# Altium schematic sheet Interface_2 SCH.SchDoc
size A4
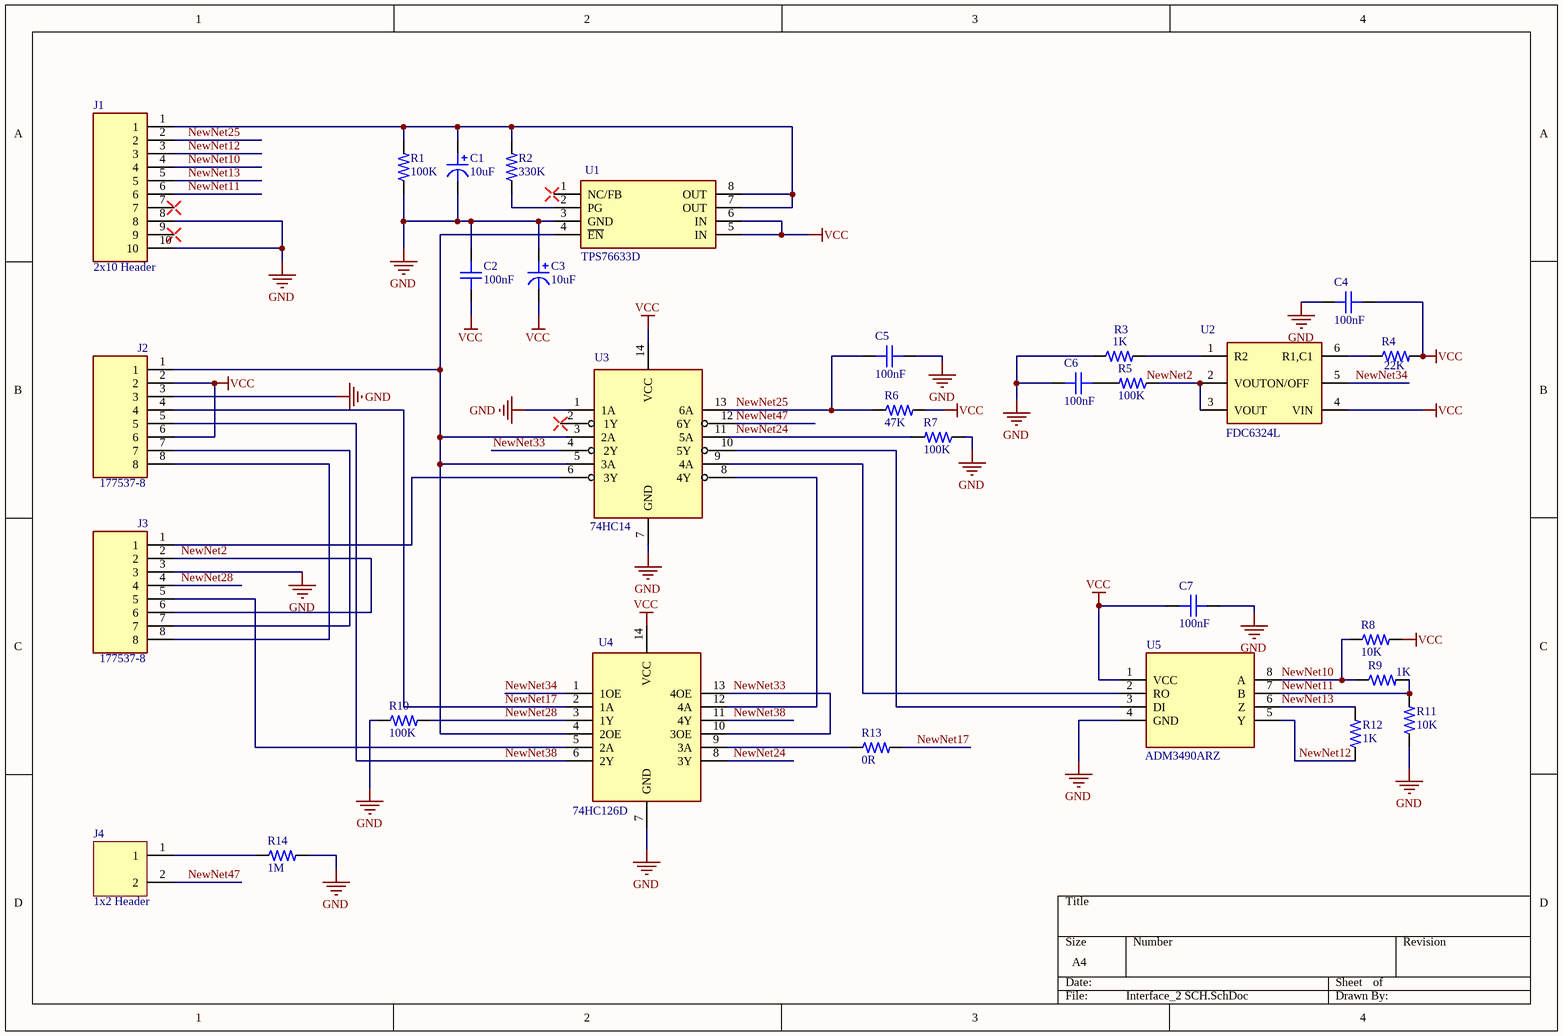
[diagram p0: Interface_2 SCH.SchDoc]

## Parts
C1  10uF  [CASE-B]
C2  100nF  [CAPC2012X14N(0805)]
C3  10uF  [CASE-B]
C4  100nF  [CAPC2012X14N(0805)]
C5  100nF  [CAPC2012X14N(0805)]
C6  100nF  [CAPC2012X14N(0805)]
C7  100nF  [CAPC2012X14N(0805)]
J1  2x10 Header  [HEADER-2x10H]
J2  177537-8  [HEADER-1X8H]
J3  177537-8  [HEADER-1X8H]
J4  1x2 Header  [HEADER-1X2H]
R1  100K  [RESC2013X70N(0805)]
R2  330K  [RESC2013X70N(0805)]
R3  1K  [RESC2013X70N(0805)]
R4  22K  [RESC2013X70N(0805)]
R5  100K  [RESC2013X70N(0805)]
R6  47K  [RESC2013X70N(0805)]
R7  100K  [RESC2013X70N(0805)]
R8  10K  [RESC2013X70N(0805)]
R9  1K  [RESC2013X70N(0805)]
R10  100K  [RESC2013X70N(0805)]
R11  10K  [RESC2013X70N(0805)]
R12  1K  [RESC2013X70N(0805)]
R13  0R  [RESC2013X70N(0805)]
R14  1M  [RESC2013X70N(0805)]
U1  TPS76633D  [SOIC-8]
U2  FDC6324L  [SUPERSOT-6]
U3  74HC14  [SO-14]
U4  74HC126D  [SO-14]
U5  ADM3490ARZ  [SOIC-8]

## Nets
GND: C1.2 C2.2 C3.1 C4.2 C5.1 C6.2 C7.1 J1.8 J1.10 J2.3 J3.3 R1.1 R3.1 R7.1 R10.1 R11.1 R14.2 U1.3(GND) U3.1(1A) U3.7(GND) U4.7(GND) U5.4(GND)
VCC: C2.1 C3.2 C4.1 C7.2 J2.2 J2.6 R4.2 R6.2 R8.2 U1.5(IN) U1.6(IN) U2.4(VIN) U3.14(VCC) U4.14(VCC) U5.1(VCC)
NewNet2: J3.2 J3.6
NewNet10: J1.4 R8.1 R9.1 U5.8(A)
NewNet11: J1.6 R9.2 R11.2 U5.7(B)
NewNet12: J1.3 R12.1 U5.5(Y)
NewNet13: J1.5 R12.2 U5.6(Z)
NewNet17: J2.4 R13.2 U4.2(1A)
NewNet24: R7.2 U3.11(5A) U4.8(3Y)
NewNet25: C5.2 J1.2 R6.1 U3.13(6A)
NewNet28: J3.4 R10.2 U4.3(1Y)
NewNet33: U3.4(2Y) U4.10(3OE) U4.13(4OE)
NewNet34: U2.5 U4.1(1OE)
NewNet38: J2.5 U4.6(2Y) U4.11(4Y)
NewNet47: J4.2 U3.12(6Y)
NetC1_1: C1.1 J1.1 R1.2 R2.2 U1.7(OUT) U1.8(OUT)
NetC6_1: C6.1 R5.2
NetJ2_1: J2.1 U1.4(~{EN}) U3.3(2A) U3.5(3A) U4.4(2OE)
NetJ2_7: J2.7 J3.7
NetJ2_8: J2.8 J3.8
NetJ3_1: J3.1 U3.6(3Y)
NetJ3_5: J3.5 U4.5(2A)
NetJ4_1: J4.1 R14.1
NetR2_1: R2.1 U1.2(PG)
NetR3_2: R3.2 U2.1(R2)
NetR4_1: R4.1 U2.6(R1,C1)
NetR5_1: R5.1 U2.2(VOUTON/OFF) U2.3(VOUT)
NetR13_1: R13.1 U4.9(3A)
NetU3_8: U3.8(4Y) U4.12(4A)
NetU3_9: U3.9(4A) U5.2(RO)
NetU3_10: U3.10(5Y) U5.3(DI)

Not connected (* = marked no-connect by the designer): J1 7 9; U1 1(NC/FB); U3 2(1Y)

## Notes on the sheet
- Labels drawn without touching a wire or pin: NewNet2

## Library data of the parts
C1 C3 = 293D106X0004A2TE3: Cap Tant Solid 10uF 4V A CASE 20% (3.2 X 1.6 X 1.6mm) SMD 3216-18 5.1 Ohm 125C T/R; Manufacturer: Vishay Sprague; Component: 22; Dielectric Material: Tantalum; Voltage Rating (DC): 0uV; Dissipation Factor: 6%; Polarity: Polar; ESR (Equivalent Series Resistance): 5.1R; Manufacturer Part Number: 293D106X0004A2TE3; Supplier 1: Avnet; Supplier Part Number 1: 293D106X0004A2TE3; RoHS: Yes; Category: Tantalum Capacitors; Pricing 1: 2000=0,14061, 4000=0,13717, 8000=0,13524, 12000=0,13138, 16000=0,12848 (USD); Mount: Surface Mount; Case/Package: Molded; Min Operating Temperature: -55°C; Max Operating Temperature: 125°C; Capacitance: 10uF; Tolerance: 20%; Packaging: Tape and Reel; Voltage Rating: 4V; Package Quantity: 2000
C2 C4-C7 = 0805YC104K4Z2A: Cap Ceramic 0.1uF 16V X7R 10% SMD 0805 FlexiTerm 125°C Paper T/R; Manufacturer: AVX; Component: 23; Manufacturer Part Number: 0805YC104K4Z2A; Supplier 1: Mouser; Supplier Part Number 1: 581-0805YC104K4Z2A; Category: Ceramic Capacitors; Stock 1: 2532; Pricing 1: 1=0,32000, 10=0,22100, 100=0,13300, 500=0,10000, 1000=0,08400, 2000=0,07100 (USD); Mount: Surface Mount; Case/Package: 0805; Min Operating Temperature: -55°C; Max Operating Temperature: 125°C; Capacitance: 100nF; Tolerance: 10%; Voltage Rating (DC): 16V; Dielectric: X7R; Length: 2.01mm; Height: 0.94mm; Depth: 1.25mm; ComponentLink1URL: https://datasheet.ciiva.com/11504/flexiterm-11504202.pdf?src-supplier=Avnet; ComponentLink1Description: https://datasheet.ciiva.com/11504/flexiterm-11504202.pdf?src-supplier=Avnet; ComponentLink2URL: https://datasheet.ciiva.com/207/flexiterm-207787.pdf?src-supplier=Digi-Key; ComponentLink2Description: https://datasheet.ciiva.com/207/flexiterm-207787.pdf?src-supplier=Digi-Key; ComponentLink3URL: http://datasheet.octopart.com/0805YC104K4Z2A-AVX-Interconnect---Elco-datasheet-5313949.pdf?src-supplier=Newark; ComponentLink3Description: http://datasheet.octopart.com/0805YC104K4Z2A-AVX-Interconnect---Elco-datasheet-5313949.pdf?src-supplier=Newark; ComponentLink4URL: http://datasheet.octopart.com/0805YC104K4Z2A-AVX-Interconnect---Elco-datasheet-8451785.pdf?src-supplier=Newark; ComponentLink4Description: http://datasheet.octopart.com/0805YC104K4Z2A-AVX-Interconnect---Elco-datasheet-8451785.pdf?src-supplier=Newark; Number of Pins: 2; Case Code (Metric): 2012; Case Code (Imperial): 0805; Packaging: Tape and Reel; Voltage Rating: 16V; Package Quantity: 4000; Termination: SMD/SMT; Width: 0.049inch; Thickness: 0.037inch; Radiation Hardening: No; ComponentLink5URL: http://datasheet.octopart.com/0805YC104K4Z2A-AVX-datasheet-13516023.pdf; ComponentLink5Description: http://datasheet.octopart.com/0805YC104K4Z2A-AVX-datasheet-13516023.pdf; Ratings: AEC-Q200; Features: Soft Termination
J1 = 1-828430-0 (2): Headers & Wire Housings 2X10P AMPMODU II STIFTLEI; Manufacturer: TE Connectivity AMP; MP: 1-1241164-0; MF: TE Connectivity; Component: 12; Availability: Bad; EU_RoHS_Compliance: Compliant; SnapEDA_Link: https://www.snapeda.com/parts/1-1241164-0/TE%20Connectivity/view-part/2365578/?ref=snap; Value: *; Price: None; Package: None; Manufacturer Part Number: 1-828430-0 (2); Supplier 1: Newark; Supplier Part Number 1: 97X0190; RoHS: Yes; Category: Headers and Wire Housings; Pricing 1: 4800=1,41000 (USD); Mount: Through Hole; Contact Plating: Gold,Tin; Housing Material: PBT; Contact Material: CuZn
J2 J3 = 90120-0928: Molex C-GRID III Series, Series Number 90120, 2.54mm Pitch 8 Way 1 Row Straight PCB Header, Solder Termination, 3A; Component: 11; Voltage Rating: 350V; Check_prices: https://www.snapeda.com/parts/177537-8/TE%20Connectivity%20AMP%20Connectors/view-part/1407135/?ref=eda; SnapEDA_Link: https://www.snapeda.com/parts/177537-8/TE%20Connectivity%20AMP%20Connectors/view-part/1407135/?ref=snap; Value: *; Manufacturer Part Number: 90120-0928; Supplier 1: Allied Electronics; Supplier Part Number 1: 70373980; Manufacturer: Molex; RoHS: Yes; Category: Headers and Wire Housings; Pricing 1: 5=0,75000, 25=0,72000, 50=0,70000, 250=0,67000, 500=0,63000 (USD); Min Operating Temperature: -55°C; Max Operating Temperature: 125°C; Contact Plating: Gold; Termination: Through Hole; Current Rating: 3A; Housing Material: Polyester; Contact Material: Brass
J4 = OSTOQ025450: TERM BLOCK HDR 2POS VERT 5.08MM; Manufacturer: On-Shore Technology; Component: 7; Number of Positions: 2; Manufacturer Part Number: OSTOQ025450; Supplier 1: Digi-Key; Supplier Part Number 1: ED2843-ND; RoHS: Yes; Category: Terminal Blocks; Stock 1: 6008; Pricing 1: 1=0,51000, 10=0,28000, 25=0,20880, 50=0,18620, 100=0,18250, 250=0,16060, 500=0,14600, 1000=0,13140, 5000=0,09855 (USD); Number of Pins: 2; Min Operating Temperature: -30°C; Max Operating Temperature: 105°C; Packaging: Bulk; Mount: Through Hole; Contact Plating: Tin; Termination: Solder; Color: Green
R1 R5 R7 R10 = RT0805BRB07100KL: Res Thin Film 0805 100K Ohm 0.1% 0.125W(1/8W) ±10ppm/C Molded SMD Paper T/R; Manufacturer: Yageo; Component: 27; Resistance: 100kR; Temperature Coefficient: 10ppm/°C; Max Power Dissipation: 125mW; Voltage Rating: 150V; Manufacturer Part Number: RT0805BRB07100KL; Supplier 1: Mouser; Supplier Part Number 1: 603-RT0805BRB07100KL; RoHS: Yes; Category: Chip SMD Resistors; Stock 1: 5448; Pricing 1: 1=0,95000, 10=0,68200, 100=0,38700, 1000=0,31300, 5000=0,26900, 10000=0,26000 (USD); Case/Package: 0805; Case Code (Imperial): 0805; Case Code (Metric): 2012; Contact Plating: Tin,Matte; Min Operating Temperature: -55°C; Max Operating Temperature: 125°C; Tolerance: 0.1%; Packaging: Tape and Reel; Number of Terminations: 2; Features: Moisture Resistant; Power Rating: 125mW; Termination: SMD/SMT; Package Quantity: 5000; Military Standard: Not; Length: 0.079inch; Height: 0.024inch; Width: 0.049inch; Depth: 1.25mm; Radiation Hardening: No; ComponentLink1URL: https://datasheet.ciiva.com/12720/pyu-rt-1-to-0-05-rohs-l-4-12720806.pdf?src-supplier=Mouser; ComponentLink1Description: https://datasheet.ciiva.com/12720/pyu-rt-1-to-0-05-rohs-l-4-12720806.pdf?src-supplier=Mouser; ComponentLink2URL: https://datasheet.ciiva.com/8887/pyu-rt-1-to-0-05-rohs-l-4-8887896.pdf?src-supplier=Avnet; ComponentLink2Description: https://datasheet.ciiva.com/8887/pyu-rt-1-to-0-05-rohs-l-4-8887896.pdf?src-supplier=Avnet; Resistor Type: Thin Film
R2 = RC2012J334CS: Res Thick Film 0805 330K Ohm 5% 0.125W(1/8W) ±100ppm/C Molded SMD T/R; Manufacturer: Samsung; Component: 19; Resistance: 330kR; Temperature Coefficient: 100ppm/°C; Max Power Dissipation: 125mW; Voltage Rating (DC): 150V; Manufacturer Part Number: RC2012J334CS; Supplier 1: Digi-Key; Supplier Part Number 1: 1276-5588-1-ND; RoHS: Yes; Category: Chip SMD Resistors; Stock 1: 24; Pricing 1: 1=0,14000, 10=0,12600 (USD); Case/Package: 0805; Case Code (Imperial): 0805; Case Code (Metric): 2012; Contact Plating: Tin; Min Operating Temperature: -55°C; Max Operating Temperature: 155°C; Tolerance: 5%; Packaging: Tape and Reel; Number of Terminations: 2; Features: Moisture Resistant; Power Rating: 125mW; Military Standard: Not; Length: 0.079inch; Height: 0.024inch; Width: 0.049inch; Depth: 1.25mm; Radiation Hardening: No; Lead Free: Lead Free; ComponentLink1URL: https://datasheet.ciiva.com/15196/getdatasheetpartid-714836-15196272.pdf?src-supplier=Verical; ComponentLink1Description: https://datasheet.ciiva.com/15196/getdatasheetpartid-714836-15196272.pdf?src-supplier=Verical; ComponentLink2URL: https://datasheet.ciiva.com/26156/chip-resistor-150112-1-26156574.pdf?src-supplier=Digi-Key; ComponentLink2Description: https://datasheet.ciiva.com/26156/chip-resistor-150112-1-26156574.pdf?src-supplier=Digi-Key; ComponentLink3URL: https://datasheet.ciiva.com/26156/chip-resistor-150112-1-26156588.pdf?src-supplier=Digi-Key; ComponentLink3Description: https://datasheet.ciiva.com/26156/chip-resistor-150112-1-26156588.pdf?src-supplier=Digi-Key; ComponentLink4URL: https://datasheet.ciiva.com/26156/chip-resistor-150112-1-26156606.pdf?src-supplier=Digi-Key; ComponentLink4Description: https://datasheet.ciiva.com/26156/chip-resistor-150112-1-26156606.pdf?src-supplier=Digi-Key; Resistor Type: Thick Film
R3 R9 R12 = CRCW08051K00FKEA: Res Thick Film 0805 1K Ohm 1% 0.125W(1/8W) ±100ppm/C Pad SMD Automotive T/R; Manufacturer: Vishay Dale; Component: 15; Resistance: 1kR; Temperature Coefficient: 100ppm/°C; Power Rating: 125mW; Voltage Rating: 150V; Manufacturer Part Number: CRCW08051K00FKEA; Supplier 1: Digi-Key; Supplier Part Number 1: 541-1.00KCCT-ND; RoHS: Yes; Category: Chip SMD Resistors; Stock 1: 304825; Pricing 1: 1=0,10000, 10=0,06000, 100=0,02450, 1000=0,01102, 2500=0,00957 (USD); Case/Package: 0805; Number of Pins: 2; Weight: 0.000194oz; Case Code (Imperial): 0805; Case Code (Metric): 2012; Contact Plating: Tin; Min Operating Temperature: -55°C; Max Operating Temperature: 155°C; Tolerance: 1%; Packaging: Tape and Reel; Composition: Thick Film; Termination: SMD/SMT; Package Quantity: 5000; Voltage Rating (DC): 150V; Military Standard: Not; Length: 2mm; Height: 0.45mm; Width: 1.25mm; Depth: 1.25mm; Radiation Hardening: No; Lead Free: Lead Free; REACH SVHC: Unknown; ComponentLink1URL: https://datasheet.ciiva.com/11808/0900766b80d98b26-11808530.pdf?src-supplier=RSComponents; ComponentLink1Description: https://datasheet.ciiva.com/11808/0900766b80d98b26-11808530.pdf?src-supplier=RSComponents; ComponentLink2URL: https://datasheet.ciiva.com/46381/1697337-46381606.pdf?src-supplier=Element14; ComponentLink2Description: https://datasheet.ciiva.com/46381/1697337-46381606.pdf?src-supplier=Element14; ComponentLink3URL: https://datasheet.ciiva.com/3258/dcrcwe3-3258215.pdf?src-supplier=Avnet; ComponentLink3Description: https://datasheet.ciiva.com/3258/dcrcwe3-3258215.pdf?src-supplier=Avnet; ComponentLink4URL: https://datasheet.ciiva.com/26312/fld-crcw-e3-data-en-26312922.pdf?src-supplier=Distrelec; ComponentLink4Description: https://datasheet.ciiva.com/26312/fld-crcw-e3-data-en-26312922.pdf?src-supplier=Distrelec; ComponentLink5URL: https://datasheet.ciiva.com/46441/1720486-46441626.pdf?src-supplier=Element14; ComponentLink5Description: https://datasheet.ciiva.com/46441/1720486-46441626.pdf?src-supplier=Element14; ComponentLink6URL: https://datasheet.ciiva.com/16213/dcrcwe3-16213643.pdf?src-supplier=Future+Electronics; ComponentLink6Description: https://datasheet.ciiva.com/16213/dcrcwe3-16213643.pdf?src-supplier=Future+Electronics; ComponentLink7URL: https://datasheet.ciiva.com/17204/dcrcwe3-17204396.pdf?src-supplier=Avnet+Europe; ComponentLink7Description: https://datasheet.ciiva.com/17204/dcrcwe3-17204396.pdf?src-supplier=Avnet+Europe
R4 = RC2012J223CS: Res Thick Film 0805 22K Ohm 5% 0.125W(1/8W) ±100ppm/C Molded SMD T/R; Manufacturer: Samsung; Component: 21; Resistance: 22kR; Temperature Coefficient: 100ppm/°C; Max Power Dissipation: 125mW; Voltage Rating (DC): 150V; Manufacturer Part Number: RC2012J223CS; Supplier 1: Arrow Electronics; Supplier Part Number 1: RC2012J223CS; RoHS: Yes; Category: Chip SMD Resistors; Stock 1: 50703; Pricing 1: 1=0,03520, 10=0,02340, 25=0,02230, 50=0,01260, 100=0,01070, 250=0,00950, 500=0,00740, 1000=0,00630, 3000=0,00540, 6000=0,00470, 15000=0,00430 (USD); Case/Package: 0805; Case Code (Imperial): 0805; Case Code (Metric): 2012; Contact Plating: Tin; Min Operating Temperature: -55°C; Max Operating Temperature: 155°C; Tolerance: 5%; Packaging: Tape and Reel; Number of Terminations: 2; Features: Moisture Resistant; Package Quantity: 1; Military Standard: Not; Length: 2mm; Height: 0.024inch; Width: 0.049inch; Depth: 1.25mm; Radiation Hardening: No; Lead Free: Lead Free; ComponentLink1URL: https://datasheet.ciiva.com/15196/getdatasheetpartid-714833-15196270.pdf?src-supplier=Verical; ComponentLink1Description: https://datasheet.ciiva.com/15196/getdatasheetpartid-714833-15196270.pdf?src-supplier=Verical; Resistor Type: Thick Film
R6 = RC0805FR-0747KL: Res Thick Film 0805 47K Ohm 1% 1/8W 100ppm/C Molded SMD Paper T/R; Manufacturer: Yageo; Component: 24; Resistance: 47kR; Temperature Coefficient: 100ppm/°C; Power Rating: 125mW; Voltage Rating: 150V; Manufacturer Part Number: RC0805FR-0747KL; Supplier 1: Digi-Key; Supplier Part Number 1: 311-47.0KCRCT-ND; RoHS: Yes; Category: Chip SMD Resistors; Stock 1: 1306383; Pricing 1: 1=0,10000, 10=0,03900, 100=0,01570, 1000=0,00705, 2500=0,00612 (USD); Case/Package: 0805; Number of Pins: 2; Case Code (Imperial): 0805; Case Code (Metric): 2012; Contact Plating: Tin,Matte; Min Operating Temperature: -55°C; Max Operating Temperature: 155°C; Tolerance: 1%; Packaging: Tape and Reel; Termination: SMD/SMT; Voltage Rating (DC): 150V; Length: 2mm; Height: 0.5mm; Width: 1.25mm; Depth: 1.25mm; Radiation Hardening: No; Lead Free: Lead Free; REACH SVHC: Unknown; ComponentLink1URL: https://datasheet.ciiva.com/7941/1686128-7941799.pdf?src-supplier=Element14; ComponentLink1Description: https://datasheet.ciiva.com/7941/1686128-7941799.pdf?src-supplier=Element14; ComponentLink2URL: https://datasheet.ciiva.com/7941/444164-7941800.pdf?src-supplier=Element14; ComponentLink2Description: https://datasheet.ciiva.com/7941/444164-7941800.pdf?src-supplier=Element14; ComponentLink3URL: https://datasheet.ciiva.com/7941/444164-7941801.pdf?src-supplier=Element14; ComponentLink3Description: https://datasheet.ciiva.com/7941/444164-7941801.pdf?src-supplier=Element14; ComponentLink4URL: https://datasheet.ciiva.com/16742/rc0805-16742265.pdf?src-supplier=Future+Electronics; ComponentLink4Description: https://datasheet.ciiva.com/16742/rc0805-16742265.pdf?src-supplier=Future+Electronics; ComponentLink5URL: https://datasheet.ciiva.com/46447/444164-46447581.pdf?src-supplier=Element14; ComponentLink5Description: https://datasheet.ciiva.com/46447/444164-46447581.pdf?src-supplier=Element14; Resistor Type: Thick Film
R8 R11 = CRCW080510K0FKEAHP: Res Thick Film 0805 10K Ohm 1% 0.33W(1/3W) ±100ppm/C Molded SMD Automotive Paper T/R; Manufacturer: Vishay; Component: 22; Resistance: 10kR; Temperature Coefficient: 100ppm/°C; Max Power Dissipation: 333mW; Power Rating: 330mW; Voltage Rating: 150V; Manufacturer Part Number: CRCW080510K0FKEAHP; Supplier 1: Digi-Key; Supplier Part Number 1: 541-10.0KTCT-ND; RoHS: Yes; Category: Chip SMD Resistors; Stock 1: 22879; Pricing 1: 1=0,24000, 10=0,20400, 100=0,07980, 1000=0,03339, 2500=0,03061 (USD); Mount: Surface Mount; Case/Package: 0805; Weight: 0.000194oz; Case Code (Imperial): 0805; Case Code (Metric): 2012; Contact Plating: Tin; Min Operating Temperature: -55°C; Max Operating Temperature: 155°C; Tolerance: 1%; Packaging: Tape and Reel; Number of Terminations: 2; Features: Automotive AEC-Q200; Termination: SMD/SMT; Package Quantity: 10; Voltage Rating (DC): 150V; Military Standard: Not; Length: 2mm; Height: 0.024inch; Width: 0.049inch; Depth: 1.25mm; Radiation Hardening: No; Lead Free: Lead Free; REACH SVHC: No SVHC; ComponentLink1URL: https://datasheet.ciiva.com/8337/crcwhpe3-8337510.pdf?src-supplier=Avnet; ComponentLink1Description: https://datasheet.ciiva.com/8337/crcwhpe3-8337510.pdf?src-supplier=Avnet; ComponentLink2URL: https://datasheet.ciiva.com/2475/crcwhpe3-2475623.pdf?src-supplier=Digi-Key; ComponentLink2Description: https://datasheet.ciiva.com/2475/crcwhpe3-2475623.pdf?src-supplier=Digi-Key; ComponentLink3URL: https://datasheet.ciiva.com/2475/crcwhpe3-2475624.pdf?src-supplier=Digi-Key; ComponentLink3Description: https://datasheet.ciiva.com/2475/crcwhpe3-2475624.pdf?src-supplier=Digi-Key; ComponentLink4URL: https://datasheet.ciiva.com/2475/crcwhpe3-2475625.pdf?src-supplier=Digi-Key; ComponentLink4Description: https://datasheet.ciiva.com/2475/crcwhpe3-2475625.pdf?src-supplier=Digi-Key; ComponentLink5URL: https://datasheet.ciiva.com/5552/crcwhpe3-46056-5552265.pdf?src-supplier=Mouser; ComponentLink5Description: https://datasheet.ciiva.com/5552/crcwhpe3-46056-5552265.pdf?src-supplier=Mouser; ComponentLink6URL: https://datasheet.ciiva.com/46392/1885357-46392604.pdf?src-supplier=Element14; ComponentLink6Description: https://datasheet.ciiva.com/46392/1885357-46392604.pdf?src-supplier=Element14; Resistor Type: Thick Film
R13 = CRCW08050000Z0EB: Res Thick Film 0805100K SMD Automotive T/R; Manufacturer: Vishay Dale; Component: 28; Resistance: 0mR; Max Power Dissipation: 125mW; Voltage Rating: 150V; Manufacturer Part Number: CRCW08050000Z0EB; Supplier 1: Digi-Key; Supplier Part Number 1: 541-CRCW08050000Z0EBCT-ND; RoHS: Yes; Category: Chip SMD Resistors; Stock 1: 60801; Pricing 1: 1=0,10000, 10=0,03800, 25=0,02800, 50=0,02120, 100=0,01560, 250=0,01192, 500=0,00954, 1000=0,00702, 5000=0,00504 (USD); Case/Package: 0805; Weight: 0.000194oz; Case Code (Imperial): 0805; Case Code (Metric): 2012; Contact Plating: Tin; Min Operating Temperature: -55°C; Max Operating Temperature: 155°C; Packaging: Tape and Reel; Number of Terminations: 2; Features: Automotive AEC-Q200; Power Rating: 125mW; Termination: SMD/SMT; Package Quantity: 10000; Voltage Rating (DC): 150V; Military Standard: Not; Length: 2mm; Height: 0.02inch; Width: 0.049inch; Depth: 1.25mm; Radiation Hardening: No; Lead Free: Lead Free; REACH SVHC: Unknown; ComponentLink1URL: https://datasheet.ciiva.com/9109/dcrcwe3-9109990.pdf?src-supplier=Avnet; ComponentLink1Description: https://datasheet.ciiva.com/9109/dcrcwe3-9109990.pdf?src-supplier=Avnet; ComponentLink2URL: https://datasheet.ciiva.com/5549/dcrcwe3-109170-5549863.pdf?src-supplier=Mouser; ComponentLink2Description: https://datasheet.ciiva.com/5549/dcrcwe3-109170-5549863.pdf?src-supplier=Mouser; ComponentLink3URL: https://datasheet.ciiva.com/9109/dcrcwe3-9109967.pdf?src-supplier=Avnet; ComponentLink3Description: https://datasheet.ciiva.com/9109/dcrcwe3-9109967.pdf?src-supplier=Avnet; Resistor Type: Thick Film
R14 = ERJ-P06J105V: Res Thick Film 0805 1M Ohm 5% 1/4W 200ppm/C Molded SMD SMD Punched Carrier T/R; Manufacturer: Panasonic; Component: 23; Resistance: 1MR; Temperature Coefficient: 200ppm/°C; Max Power Dissipation: 500mW; Voltage Rating: 400V; Voltage Rating (DC): 150V; Manufacturer Part Number: ERJ-P06J105V; Supplier 1: Digi-Key; Supplier Part Number 1: P1.0MADCT-ND; RoHS: Yes; Category: Chip SMD Resistors; Stock 1: 38353; Pricing 1: 1=0,11000, 10=0,09900, 100=0,03820, 1000=0,01679, 2500=0,01450 (USD); Mount: Surface Mount; Case/Package: 0805; Case Code (Imperial): 0805; Case Code (Metric): 2012; Contact Plating: Tin; Min Operating Temperature: -55°C; Max Operating Temperature: 155°C; Tolerance: 5%; Packaging: Tape and Reel; Number of Terminations: 2; Features: Automotive AEC-Q200; Power Rating: 500mW; Termination: SMD/SMT; Package Quantity: 1; Military Standard: Not; Length: 2mm; Height: 0.6mm; Width: 0.049inch; Depth: 1.25mm; Radiation Hardening: No; Lead Free: Lead Free; REACH SVHC: Unknown; ComponentLink1URL: https://datasheet.ciiva.com/11815/0900766b812cb812-11815881.pdf?src-supplier=RSComponents; ComponentLink1Description: https://datasheet.ciiva.com/11815/0900766b812cb812-11815881.pdf?src-supplier=RSComponents; ComponentLink2URL: https://datasheet.ciiva.com/16781/70068906-16781958.pdf?src-supplier=Allied+Electronics; ComponentLink2Description: https://datasheet.ciiva.com/16781/70068906-16781958.pdf?src-supplier=Allied+Electronics; ComponentLink3URL: https://datasheet.ciiva.com/16782/70068906-16782920.pdf?src-supplier=Allied+Electronics; ComponentLink3Description: https://datasheet.ciiva.com/16782/70068906-16782920.pdf?src-supplier=Allied+Electronics; ComponentLink4URL: https://datasheet.ciiva.com/16785/70068906-16785434.pdf?src-supplier=Allied+Electronics; ComponentLink4Description: https://datasheet.ciiva.com/16785/70068906-16785434.pdf?src-supplier=Allied+Electronics; ComponentLink5URL: https://datasheet.ciiva.com/7909/1913273-7909563.pdf?src-supplier=Element14; ComponentLink5Description: https://datasheet.ciiva.com/7909/1913273-7909563.pdf?src-supplier=Element14; ComponentLink6URL: https://datasheet.ciiva.com/24044/aoa0000ce4-64075-24044221.pdf?src-supplier=Mouser; ComponentLink6Description: https://datasheet.ciiva.com/24044/aoa0000ce4-64075-24044221.pdf?src-supplier=Mouser; ComponentLink7URL: https://datasheet.ciiva.com/17215/aoa0000ce4-17215262.pdf?src-supplier=Avnet+Europe; ComponentLink7Description: https://datasheet.ciiva.com/17215/aoa0000ce4-17215262.pdf?src-supplier=Avnet+Europe; Resistor Type: Thick Film
U1 = TPS76633DG4: IC REG LINEAR 3.3V 250MA 8SOIC; Manufacturer: Texas Instruments; Component: 16; Max Power Dissipation: 904mW; Check_prices: https://www.snapeda.com/parts/TPS76633D/Texas%20Instruments/view-part/480898/?ref=eda; SnapEDA_Link: https://www.snapeda.com/parts/TPS76633D/Texas%20Instruments/view-part/480898/?ref=snap; Value: *; Manufacturer Part Number: TPS76633DG4; Supplier 1: Mouser; Supplier Part Number 1: 595-TPS76633DG4; RoHS: Yes; Category: Voltage Regulators - Linear; Stock 1: 525; Pricing 1: 1=1,59000, 10=1,35000, 100=1,04000, 250=0,91300, 500=0,86400, 1000=0,67200, 2500=0,63900, 5000=0,61500, 10000=0,59600 (USD); Case/Package: D; Number of Pins: 8; Min Operating Temperature: -40°C; Max Operating Temperature: 125°C
U2 = FDC6324L: IC LOAD SWITCH INT 20VIN SSOT-6; Manufacturer: ON Semiconductor / Fairchild; Component: 17; Manufacturer Part Number: FDC6324L; Supplier 1: Digi-Key; Supplier Part Number 1: FDC6324LCT-ND; RoHS: Yes; Category: Hot Swap Controllers; Stock 1: 56731; Pricing 1: 1=0,60000, 10=0,52900, 25=0,49680, 100=0,37670, 250=0,32060, 500=0,30458, 1000=0,23244 (USD); Case/Package: SOT-23-6; Number of Pins: 6; Min Operating Temperature: -55°C; Max Operating Temperature: 150°C; Mount: Surface Mount; Weight: 0.036g
U3 = 74HC14D653: IC, HEX INVERTER, SCHMITT TRIGGER SOIC14; Manufacturer: NXP Semiconductors; MP: 74ACT14SCX; MF: ON Semiconductor; Component: 15; Output Current: 25mA; Min Supply Voltage: 2V; Max Supply Voltage: 6V; Number of Inputs: 1; Turn-On Delay Time: 21ns; Propagation Delay: 190ns; Number of Circuits: 6; Logic Function: Buffer,Inverter,Schmitt Trigger; Low Level Output Current: 5.2mA; Quiescent Current: 2uA; High Level Output Current: -5.2mA; Operating Supply Voltage: 5V; DigiKey-Purchase-URL: https://snapeda.com/shop?store=DigiKey&id=2312735; SnapEDA_Link: https://www.snapeda.com/parts/74ACT14SCX/ON%20Semiconductor/view-part/2312735/?ref=snap; Availability: Unavailable; Package: SOIC-14 ON Semiconductor; Value: *; Price: None; Manufacturer Part Number: 74HC14D653; Supplier 1: Arrow Electronics; Supplier Part Number 1: 74HC14D,653; RoHS: Yes; Category: Logic Gates; Case/Package: SO; Number of Pins: 14; Min Operating Temperature: -40°C; Max Operating Temperature: 125°C; Package Quantity: 2500; Packaging: Tape and Reel; Mount: Surface Mount; Weight: 0.009143oz; Contact Plating: Gold; Number of Elements: 6
U4 = 74HC126D-Q100J: Buffer/Line Driver 4-CH Non-Inverting 3-ST CMOS 14-Pin SO T/R; Manufacturer: NXP Semiconductors; MF: Toshiba Semiconductor; Component: 18; Logic Function: Buffer; Availability: Unavailable; Price: None; SnapEDA_Link: https://www.snapeda.com/parts/74HC126D/Toshiba%20Semiconductor%20and%20Storage/view-part/32960/?ref=snap; Value: *; Package: SOIC-14 NXP Semiconductors; MP: 74HC126D; Manufacturer Part Number: 74HC126D-Q100J; Supplier 1: Newark; Supplier Part Number 1: 74AH2414; RoHS: Yes; Category: Logic Gates; Stock 1: 2500; Pricing 1: 5=0,36900, 10=0,30900, 25=0,26900, 50=0,22800, 100=0,18800, 250=0,17400, 500=0,16000, 1000=0,14600 (USD); Case/Package: SO; Number of Pins: 14
U5 = ADM3490ARZ: Single Transmitter/Receiver RS-422/RS-485 8-Pin SOIC N Tube; MF: Analog Devices; Component: 19; SnapEDA_Link: https://www.snapeda.com/parts/ADM3490ARZ/Analog%20Devices%20Inc./view-part/242544/?ref=snap; Value: *; Availability: Unavailable; Price: None; MP: ADM3490ARZ; Package: SOIC-8 Analog Devices; Manufacturer Part Number: ADM3490ARZ; Supplier 1: Digi-Key; Supplier Part Number 1: ADM3490ARZ-ND; Manufacturer: Analog Devices; RoHS: Yes; Category: RS-232 / RS-422 / RS-485 Interface ICs; Stock 1: 769; Pricing 1: 1=2,76000, 10=2,47500, 25=2,34000, 100=1,92400, 250=1,72640, 500=1,66400, 1000=1,50800 (USD); Case/Package: SOIC; Number of Pins: 8; Min Operating Temperature: -40°C; Max Operating Temperature: 85°C; Weight: 0.019048oz; Contact Plating: Tin,Matte